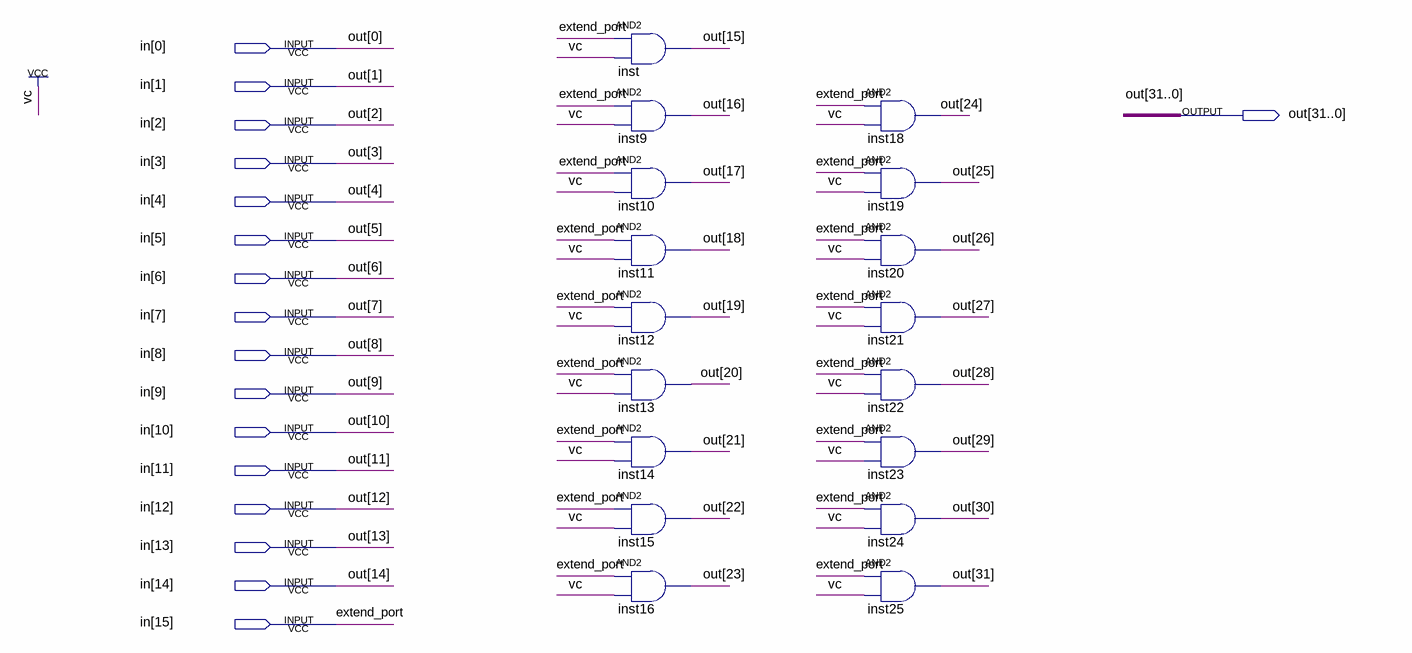
[diagram p0: schematic sheet]
// Quartus schematic 16extend32_signed.bdf as structural Verilog: 17 symbols, 17 pins
module \16extend32_signed  (
  input  [15:0] in,
  output [31:0] out
);

  and inst (out[15], in[15], 1'b1);
  and inst9 (out[16], in[15], 1'b1);
  and inst10 (out[17], in[15], 1'b1);
  and inst11 (out[18], in[15], 1'b1);
  and inst12 (out[19], in[15], 1'b1);
  and inst13 (out[20], in[15], 1'b1);
  and inst14 (out[21], in[15], 1'b1);
  and inst15 (out[22], in[15], 1'b1);
  and inst16 (out[23], in[15], 1'b1);
  and inst18 (out[24], in[15], 1'b1);
  and inst19 (out[25], in[15], 1'b1);
  and inst20 (out[26], in[15], 1'b1);
  and inst21 (out[27], in[15], 1'b1);
  and inst22 (out[28], in[15], 1'b1);
  and inst23 (out[29], in[15], 1'b1);
  and inst24 (out[30], in[15], 1'b1);
  and inst25 (out[31], in[15], 1'b1);

  assign out[14:0] = in[14:0];

  // Other names for the same wires on the sheet: extend_port = in[15]
endmodule
